# EAGLE design radio_module_V3.0 (EAGLE 7.3.0)
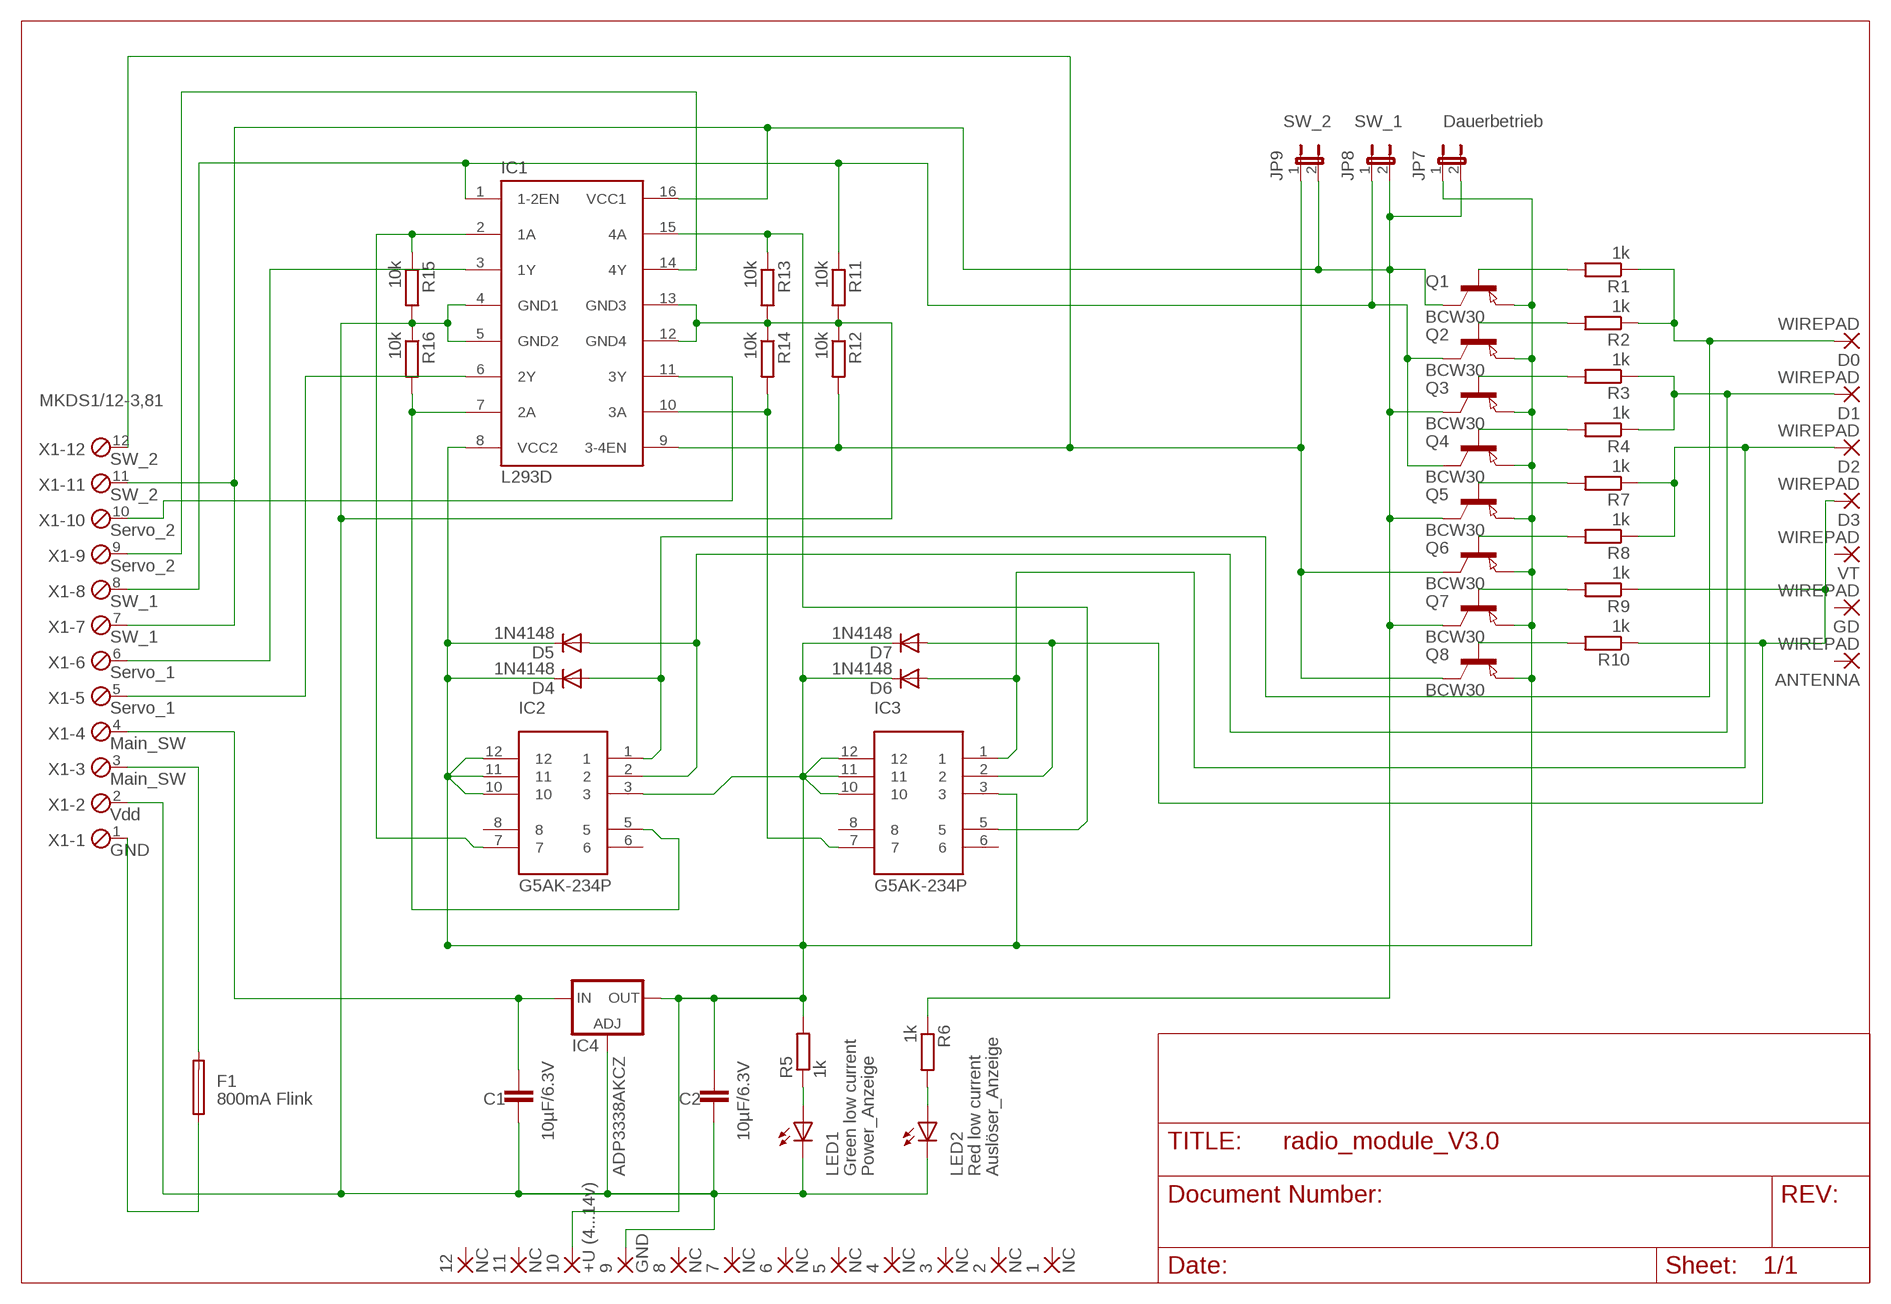
[diagram p0: schematic, sheet 1]

## Parts
1  NC  1,6/0,9  [1,6/0,9]
2  NC  1,6/0,9  [1,6/0,9]
3  NC  1,6/0,9  [1,6/0,9]
4  NC  1,6/0,9  [1,6/0,9]
5  NC  1,6/0,9  [1,6/0,9]
6  NC  1,6/0,9  [1,6/0,9]
7  NC  1,6/0,9  [1,6/0,9]
8  NC  1,6/0,9  [1,6/0,9]
9  GND  1,6/0,9  [1,6/0,9]
10  +U (4...14v)  1,6/0,9  [1,6/0,9]
11  NC  1,6/0,9  [1,6/0,9]
12  NC  1,6/0,9  [1,6/0,9]
ANTENNA  WIREPAD  1,6/0,9  [1,6/0,9]
C1  10µF/6.3V  C-EUC0805  [C0805]
C2  10µF/6.3V  C-EUC0805  [C0805]
D0  WIREPAD  1,6/0,9  [1,6/0,9]
D1  WIREPAD  1,6/0,9  [1,6/0,9]
D2  WIREPAD  1,6/0,9  [1,6/0,9]
D3  WIREPAD  1,6/0,9  [1,6/0,9]
D4  1N4148  1N4148DO35-7  [DO35-7]
D5  1N4148  1N4148DO35-7  [DO35-7]
D6  1N4148  1N4148DO35-7  [DO35-7]
D7  1N4148  1N4148DO35-7  [DO35-7]
F1  800mA Flink  FUSE19560  [19560]
GD  WIREPAD  1,6/0,9  [1,6/0,9]
IC1  L293D  [DIL16]
IC2  G5AK-234P  [G5AK-234P]
IC3  G5AK-234P  [G5AK-234P]
IC4  ADP3338AKCZ  LD117AS12TR  [SOT223]
JP7  Dauerbetrieb  JP1E  [JP1]
JP8  SW_1  JP1E  [JP1]
JP9  SW_2  JP1E  [JP1]
LED1  Green low current  LED3MM  [LED3MM]
LED2  Red low current  LED3MM  [LED3MM]
Q1  BCW30  PNP-TRANSISTOR_SOT23  [SOT23]
Q2  BCW30  PNP-TRANSISTOR_SOT23  [SOT23]
Q3  BCW30  PNP-TRANSISTOR_SOT23  [SOT23]
Q4  BCW30  PNP-TRANSISTOR_SOT23  [SOT23]
Q5  BCW30  PNP-TRANSISTOR_SOT23  [SOT23]
Q6  BCW30  PNP-TRANSISTOR_SOT23  [SOT23]
Q7  BCW30  PNP-TRANSISTOR_SOT23  [SOT23]
Q8  BCW30  PNP-TRANSISTOR_SOT23  [SOT23]
R1  1k  R-EU_R0402  [R0402]
R2  1k  R-EU_R0402  [R0402]
R3  1k  R-EU_R0402  [R0402]
R4  1k  R-EU_R0402  [R0402]
R5  1k  R-EU_R0402  [R0402]
R6  1k  R-EU_R0402  [R0402]
R7  1k  R-EU_R0402  [R0402]
R8  1k  R-EU_R0402  [R0402]
R9  1k  R-EU_R0402  [R0402]
R10  1k  R-EU_R0402  [R0402]
R11  10k  R-EU_R0402  [R0402]
R12  10k  R-EU_R0402  [R0402]
R13  10k  R-EU_R0402  [R0402]
R14  10k  R-EU_R0402  [R0402]
R15  10k  R-EU_R0402  [R0402]
R16  10k  R-EU_R0402  [R0402]
VT  WIREPAD  1,6/0,9  [1,6/0,9]
X1  MKDS1/12-3,81  [12POL381]

## Nets
GND: 9.1(P) C1.2 C2.2 IC1.4(GND1) IC1.5(GND2) IC1.12(GND4) IC1.13(GND3) IC4.1(ADJ) LED1.K(C) LED2.K(C) R11.2 R12.1 R13.2 R14.1 R15.2 R16.1 X1.2
N$1: IC1.3(1Y) X1.6
N$2: IC1.6(2Y) X1.5
N$3: IC1.7(2A) IC2.5 R16.2
N$4: IC1.11(3Y) X1.10
N$5: Q1.1(B) R1.2
N$6: Q3.1(B) R3.2
N$7: Q5.1(B) R7.2
N$8: Q7.1(B) R9.2
N$9: Q2.1(B) R2.2
N$10: Q4.1(B) R4.2
N$11: Q6.1(B) R8.2
N$12: Q8.1(B) R10.2
N$14: IC1.16(VCC1) JP7.2 JP8.2 JP9.2 Q1.3(C) Q3.3(C) Q5.3(C) Q7.3(C) R6.1 X1.7 X1.11
N$16: IC1.2(1A) IC2.7 R15.1
N$18: D0.1(P) D4.A IC2.1 R1.1 R2.1
N$19: LED2.A R6.2
N$20: F1.1 X1.1
N$21: D1.1(P) D5.A IC2.2 R3.1 R4.1
N$22: IC1.14(4Y) X1.9
N$24: F1.2 X1.3
N$25: D3.1(P) D7.A IC3.2 R9.1 R10.1
N$26: IC1.10(3A) IC3.7 R14.2
N$27: IC1.15(4A) IC3.5 R13.1
N$28: C1.1 IC4.3(IN) X1.4
N$31: LED1.A R5.1
N$32: D2.1(P) D6.A IC3.1 R7.1 R8.1
N$33: IC1.1(1-2EN) JP8.1 Q2.3(C) Q4.3(C) R11.1 X1.8
N$34: IC1.9(3-4EN) JP9.1 Q6.3(C) Q8.3(C) R12.2 X1.12
VDD: 10.1(P) C2.1 D4.C D5.C D6.C D7.C IC1.8(VCC2) IC2.3 IC2.10 IC2.11 IC2.12 IC3.3 IC3.10 IC3.11 IC3.12 IC4.4(OUT) JP7.1 Q1.2(E) Q2.2(E) Q3.2(E) Q4.2(E) Q5.2(E) Q6.2(E) Q7.2(E) Q8.2(E) R5.2
Unconnected: 1.1(P) 2.1(P) 3.1(P) 4.1(P) 5.1(P) 6.1(P) 7.1(P) 8.1(P) 11.1(P) 12.1(P) ANTENNA.1(P) GD.1(P) IC2.6 IC2.8 IC3.6 IC3.8 VT.1(P)

## Notes on the sheet
- SW_2
- SW_2
- Servo_2
- Servo_2
- SW_1
- SW_1
- Servo_1
- Servo_1
- Main_SW
- Main_SW
- Vdd
- GND
- Power_Anzeige | Auslöser_Anzeige

## Library data of the parts
1-12 ANTENNA D0 D1-D3 GD VT = wirepad:1,6/0,9: THROUGH-HOLE PAD
C1 C2 = rcl:C-EU: CAPACITOR, European symbol
D4-D7 = diode:1N4148: DIODE high speed (Philips)
F1 = fuse:FUSE: Fuse
IC1 = st-microelectronics:L293D: PUSH-PULL 4 CHANNEL DRIVER
IC2 IC3 = omron:G5AK-234P
IC4 = v-reg:LD117A?*: Low drop fixed and adjustable positive voltage regulators 1 A Source: http://www.st.com/stonline/products/literature/ds/7194/ld1117axx.pdf
JP7-JP9 = jumper:JP1E: JUMPER
LED1 LED2 = led:LED: LED OSRAM: - CHIPLED LG R971, LG N971, LY N971, LG Q971, LY Q971, LO R971, LY R971 LH N974, LH R974 LS Q976, LO Q976, LY Q976 LO Q996 - Hyper CHIPLED LW Q18S LB Q993, LB Q99A, LB R99A - SideLED LS A670, LO A670, LY A670, LG A670, LP A670 LB A673, LV A673, LT A673, LW A673 LH A674 LY A675 LS A676, LA A676, LO A676, LY A676, LW A676 LS A679, LY A679, LG A679 - Hyper Micro SIDELED® LS Y876, LA Y876, LO Y876, LY Y876 LT Y87S - SmartLED LW L88C, LW L88S LB L89C, LB L89S, LG L890 LS L89K, LO L89K, LY L89K LS L896, LA L896, LO L896, LY L896 - TOPLED LS T670, LO T670, LY T670, LG T670, LP T670 LSG T670, LSP T670, LSY T670, LOP T670, LYG T670 LG T671, LOG T671, LSG T671 LB T673, LV T673, LT T673, LW T673 LH T674 LS T676, LA T676, LO T676, LY T676, LB T676, LH T676, LSB T676, LW T676 LB T67C, LV T67C, LT T67C, LS T67K, LO T67K, LY T67K, LW E67C LS E67B, LA E67B, LO E67B, LY E67B, LB E67C, LV E67C, LT E67C LW T67C LS T679, LY T679, LG T679 LS T770, LO T770, LY T770, LG T770, LP T770 LB T773, LV T773, LT T773, LW T773 LH T774 LS E675, LA E675, LY E675, LS T675 LS T776, LA T776, LO T776, LY T776, LB T776 LHGB T686 LT T68C, LB T68C - Hyper Mini TOPLED® LB M676 - Mini TOPLED Santana® LG M470 LS M47K, LO M47K, LY M47K Source: http://www.osram.convergy.de LUXEON: - LUMILED® LXK2-PW12-R00, LXK2-PW12-S00, LXK2-PW14-U00, LXK2-PW14-V00 LXK2-PM12-R00, LXK2-PM12-S00, LXK2-PM14-U00 LXK2-PE12-Q00, LXK2-PE12-R00, LXK2-PE12-S00, LXK2-PE14-T00, LXK2-PE14-U00 LXK2-PB12-K00, LXK2-PB12-L00, LXK2-PB12-M00, LXK2-PB14-N00, LXK2-PB14-P00, LXK2-PB14-Q00 LXK2-PR12-L00, LXK2-PR12-M00, LXK2-PR14-Q00, LXK2-PR14-R00 LXK2-PD12-Q00, LXK2-PD12-R00, LXK2-PD12-S00 LXK2-PH12-R00, LXK2-PH12-S00 LXK2-PL12-P00, LXK2-PL12-Q00, LXK2-PL12-R00 Source: www.luxeon.com KINGBRIGHT: KA-3528ASYC Source: www.kingbright.com
Q1-Q8 = semicon-smd-ipc:PNP-TRANSISTOR_: PNP TRANSISTOR
R1-R16 = resistor:R-EU_: RESISTOR, European symbol
X1 = con-phoenix-381:MKDS1/12-3,81: MKDS 1/12-3,81 - Order No. 1727117 Pitch: 3,81mm Number of terminals: 12 Rated Voltage: 160V Maximum load current/ cross section: 12A/1.5mm2-AWG16 Housing Interlocking: none Color: Green

## Board
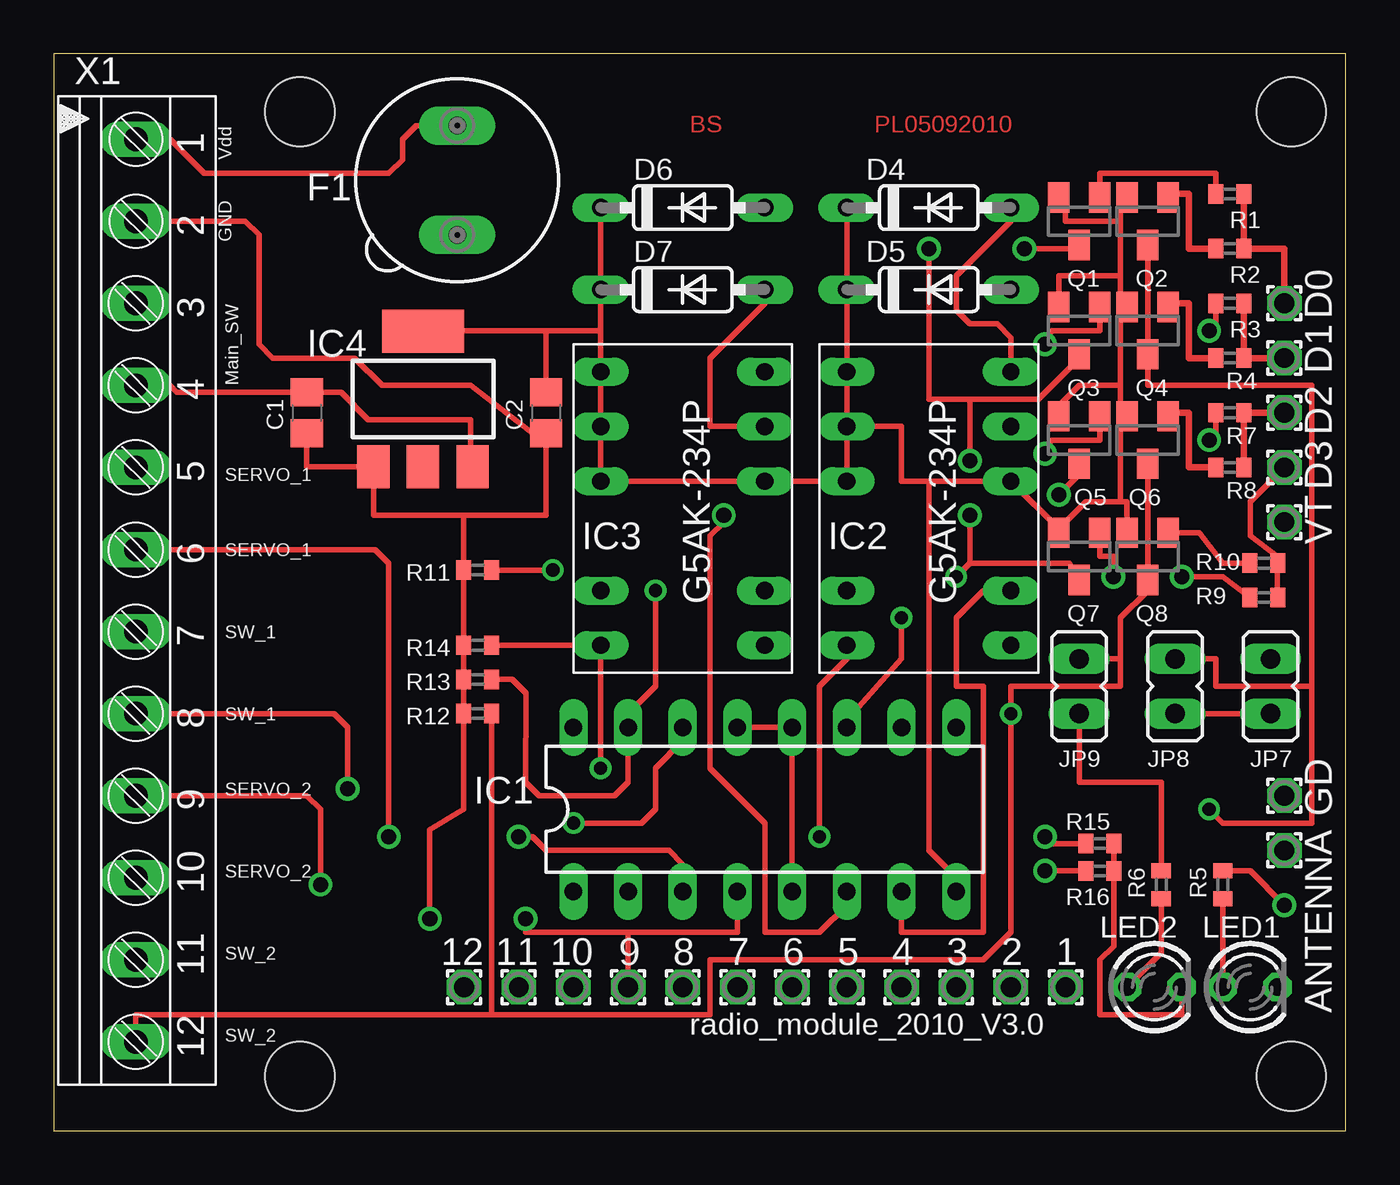
[diagram p1: board, top side]
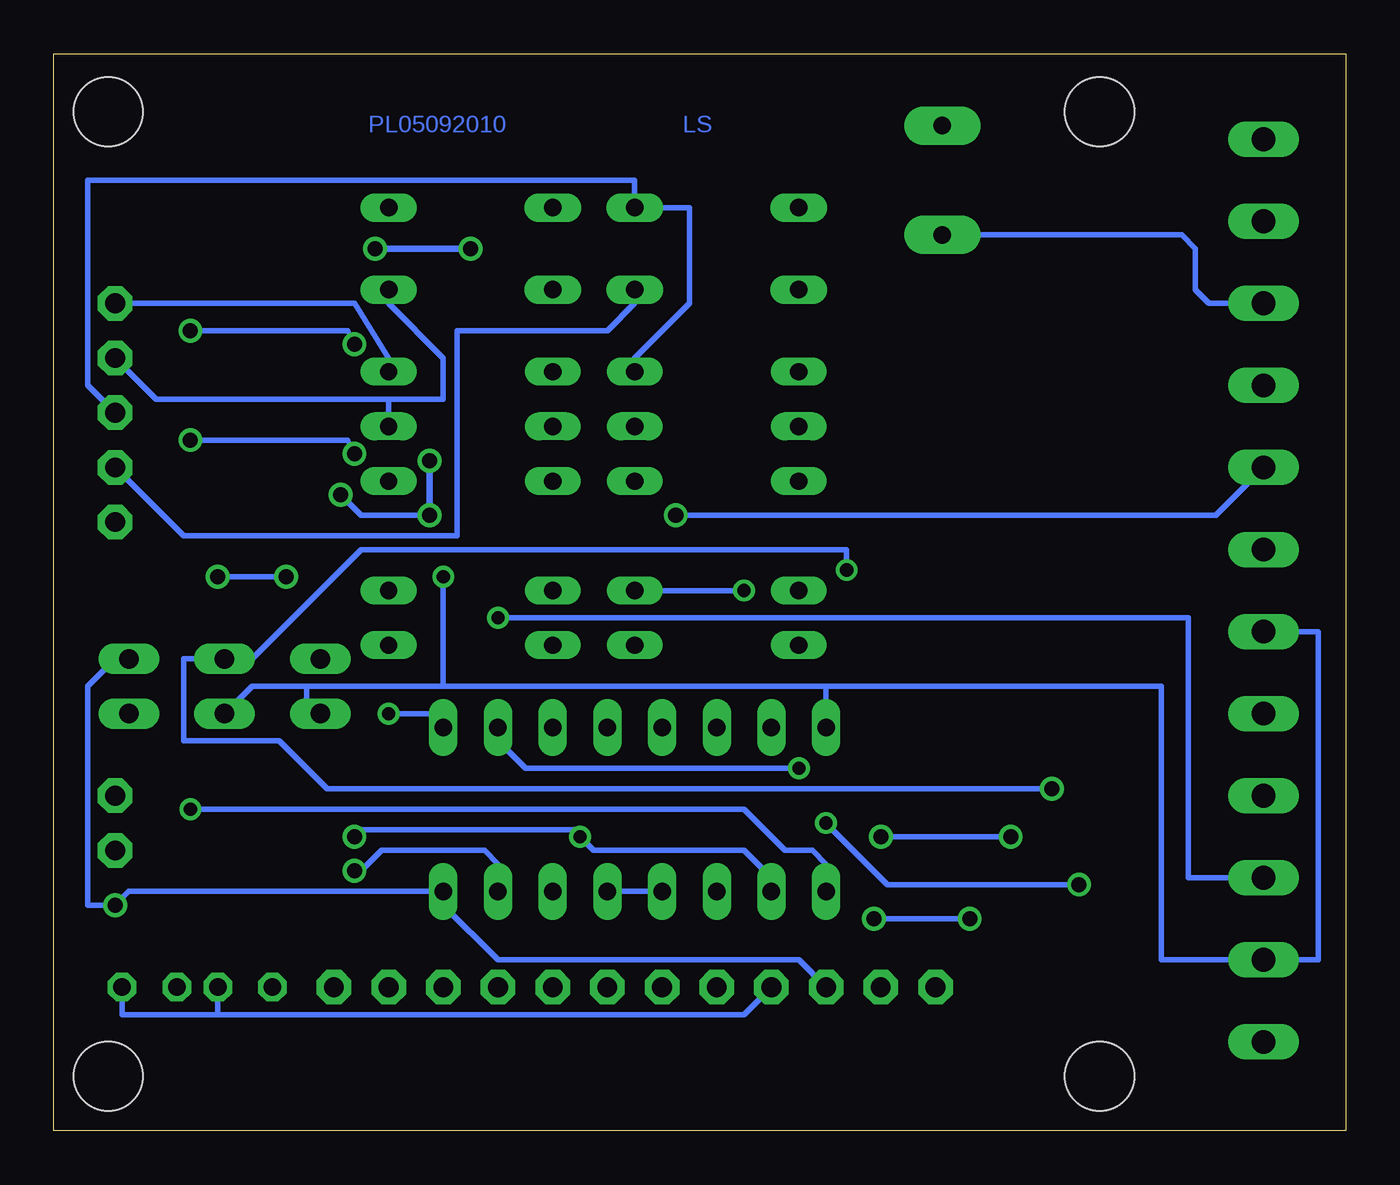
[diagram p2: board, bottom side, seen from below]

Size 60 x 50 mm. Coordinates in mm from the lower left corner, seen from the top.
Outline: 0,0 60,0 60,50 0,50 0,0
Copper layers (1*16): Top 0.035mm / dielectric 1.5mm / Bottom 0.035mm
Design rules "default *": minimum track width 10mil, minimum drill 24mil, track to track 8mil, track to pad 8mil, pad to pad 8mil, via to via 8mil, smd to smd 8mil, copper to edge 40mil, drill to drill 8mil, minimum pad ring 10mil, minimum via ring 8mil, stop-mask expansion 4mil, vias tented up to drill 0mil, thermal gap 10mil
Holes 3.2 mm at 57.47,47.31 57.47,2.54 11.43,2.54 11.43,47.31

### Footprints (pad centres in the part's own frame; a part is rotated, then mirrored left to right if it is on the bottom)
1,6/0,9 = drill 0.914 pad 1.6 octagon: 1 0,0
C0805 = smd 1.3 x 1.5: 1 -0.95,0; 2 0.95,0
DO35-7 = drill 0.813 long: A 3.81,0; C -3.81,0
19560 = drill 0.813 pad 1.778 long: 1 -2.54,0; 2 2.54,0
DIL16 = drill 0.813 long: 1 -8.89,-3.81; 2 -6.35,-3.81; 3 -3.81,-3.81; 4 -1.27,-3.81; 5 1.27,-3.81; 6 3.81,-3.81; 7 6.35,-3.81; 8 8.89,-3.81; 9 8.89,3.81; 10 6.35,3.81; 11 3.81,3.81; 12 1.27,3.81; 13 -1.27,3.81; 14 -3.81,3.81; 15 -6.35,3.81; 16 -8.89,3.81
G5AK-234P = drill 0.8 long: 1 1.27,8.89; 2 3.81,8.89; 3 6.35,8.89; 5 11.43,8.89; 6 13.97,8.89; 7 13.97,1.27; 8 11.43,1.27; 10 6.35,1.27; 11 3.81,1.27; 12 1.27,1.27
SOT223 = smd 1.5 x 2: 1 -2.3,-3.15; 2 0,-3.15; 3 2.3,-3.15 | smd 3.8 x 2: 4 0,3.15
JP1 = drill 0.914 long: 1 0,-1.27; 2 0,1.27
LED3MM = drill 0.813 octagon: A -1.27,0; K 1.27,0
SOT23 = smd 1 x 1.4: 1 -0.95,-1.1; 2 0.95,-1.1; 3 0,1.1
R0402 = smd 0.7 x 0.9: 1 -0.65,0; 2 0.65,0
12POL381 = drill 1.1 long: 1 0,0; 2 3.81,0; 3 7.62,0; 4 11.43,0; 5 15.24,0; 6 19.05,0; 7 22.86,0; 8 26.67,0; 9 30.48,0; 10 34.29,0; 11 38.1,0; 12 41.91,0

### Placement (x,y rotation side)
1  46.99,6.67 0 top
2  44.45,6.67 0 top
3  41.91,6.67 0 top
4  39.37,6.67 0 top
5  36.83,6.67 0 top
6  34.29,6.67 0 top
7  31.75,6.67 0 top
8  29.21,6.67 0 top
9  26.67,6.67 0 top
10  24.13,6.67 0 top
11  21.59,6.67 0 top
12  19.05,6.67 0 top
ANTENNA  57.15,13.02 270 top
C1  11.75,33.34 270 top
C2  22.86,33.34 270 top
D0  57.15,38.42 270 top
D1  57.15,35.88 270 top
D2  57.15,33.34 270 top
D3  57.15,30.8 270 top
D4  40.64,42.86 0 top
D5  40.64,39.05 0 top
D6  29.21,42.86 0 top
D7  29.21,39.05 0 top
F1  18.73,44.13 270 top
GD  57.15,15.56 90 top
IC1  33.02,14.92 0 top
IC2  35.56,36.51 270 top
IC3  24.13,36.51 270 top
IC4  17.14,33.97 0 top
JP7  56.52,20.64 180 top
JP8  52.07,20.64 180 top
JP9  47.62,20.64 180 top
LED1  55.56,6.67 0 top
LED2  51.12,6.67 0 top
Q1  47.62,42.23 180 top
Q2  50.8,42.23 180 top
Q3  47.62,37.15 180 top
Q4  50.8,37.15 180 top
Q5  47.62,32.07 180 top
Q6  50.8,32.07 180 top
Q7  47.62,26.67 180 top
Q8  50.8,26.67 180 top
R1  54.61,43.5 180 top
R2  54.61,40.96 180 top
R3  54.61,38.42 180 top
R4  54.61,35.88 180 top
R5  54.29,11.43 90 top
R6  51.44,11.43 270 top
R7  54.61,33.34 180 top
R8  54.61,30.8 180 top
R9  56.2,24.77 180 top
R10  56.2,26.35 180 top
R11  19.68,26.04 180 top
R12  19.68,19.37 0 top
R13  19.68,20.95 180 top
R14  19.68,22.54 0 top
R15  48.58,13.34 0 top
R16  48.58,12.06 180 top
VT  57.15,28.26 270 top
X1  3.81,46.04 270 top

### Tracks (layer width: path | path; a pad name or v marks a point on that pad's centre or on a via)
GND  (via drill 0.7)
  Top 0.254: 26.67,9.21 9.1 | 26.67,9.21 31.75,9.21 IC1.4 | 26.67,9.21 21.91,9.21 v21.91,9.84 | v17.46,9.84 17.46,13.97 19.04,14.92 R12.1 R13.2 R14.1 R11.2 | IC1.5 IC1.12 IC1.13 | R11.2 | R15.2 R16.1 49.23,8.56 48.58,7.94 48.58,5.4 52.39,5.4 LED2.K | C1.2 11.75,30.82 IC4.1 14.85,28.57 19.05,28.57 | X1.2 8.89,42.23 9.53,41.59 9.53,36.51 10.16,35.88 13.97,35.88 15.24,34.61 19.37,34.61 22.23,32.38 22.23,32.39 C2.2 22.86,28.57 19.05,28.57 | R11.2 19.04,28.56 19.05,28.57
  Bottom 0.254: 9.1 27.94,5.4 52.39,5.4 | v17.46,9.84 v21.91,9.84 | IC1.4 IC1.5 | 52.39,5.4 LED2.K | 52.39,5.4 56.83,5.4 LED1.K
N$1  (via drill 0.7)
  Top 0.254: v21.59,13.65 22.23,13.65 22.86,13.02 28.57,13.02 29.21,12.38 IC1.3 | v15.56,13.65 15.56,26.35 14.92,26.99 X1.6
  Bottom 0.254: v15.56,13.65 v21.59,13.65
N$2  (via drill 0.7)
  Top 0.254: v31.11,28.57 31.11,28.26 30.48,27.62 30.48,16.83 33.02,14.29 33.02,9.21 35.56,9.21 36.83,10.48 IC1.6
  Bottom 0.254: v31.11,28.57 6.03,28.57 X1.5
N$3  (via drill 0.7 pad 0.81)
  Top 0.254: IC2.5 43.18,25.08 41.91,23.81 41.91,20.64 43.18,20.64 43.18,9.21 39.37,9.21 IC1.7 | v46.04,12.06 R16.2
  Bottom 0.254: v46.04,12.06 45.72,12.06 44.77,13.02 40.01,13.02 39.37,12.38 IC1.7
N$4  (via drill 0.61)
  Top 0.254: v39.37,23.81 39.37,21.91 36.83,19.05 IC1.11
  Bottom 0.254: v39.37,23.81 7.3,23.81 7.3,11.75 X1.10
N$5
  Top 0.254: Q1.1 48.58,44.45 53.98,44.45 53.98,43.5
  Top 0.305: 53.98,43.5 R1.2
N$6  (via drill 0.7)
  Top 0.254: v53.66,37.15 53.96,37.15 R3.2 | Q3.1 48.58,37.15 46.35,37.15 v46.04,36.51
  Top 0.305: R3.2 53.98,38.42
  Bottom 0.254: v46.04,36.51 46.35,37.15 v53.66,37.15
N$7  (via drill 0.7)
  Top 0.254: 53.98,33.34 R7.2 53.96,32.07 v53.66,32.07 | Q5.1 48.58,32.07 46.35,32.07 v46.04,31.43
  Bottom 0.254: v46.04,31.43 46.35,32.07 v53.66,32.07
N$8  (via drill 0.7)
  Top 0.254: Q7.1 48.58,26.67 49.21,26.67 v49.21,25.72 | v52.39,25.72 54.29,25.72 R9.2
  Bottom 0.254: v49.21,25.72 v52.39,25.72
N$9
  Top 0.305: R2.2 52.7,40.96 52.7,43.5 51.75,43.5 Q2.1
N$10
  Top 0.305: R4.2 52.7,35.88 52.7,38.42 51.75,38.42 Q4.1
N$11
  Top 0.305: R8.2 52.7,30.8 52.7,33.34 51.75,33.34 Q6.1
N$12
  Top 0.254: Q8.1 53.19,27.77 54.29,26.35 R10.2
N$14  (via drill 0.61, 0.7)
  Top 0.254: JP8.2 JP7.2 | 42.55,26.35 v42.55,28.57 | 42.55,26.35 47.16,26.35 Q7.3 | 42.55,33.97 45.72,33.97 | v42.55,31.11 42.55,33.97 | v40.64,40.96 40.64,33.97 42.55,33.97 | Q5.3 47.62,30.48 v46.67,29.53 | v41.91,25.72 42.55,26.35 | R6.1 51.44,16.19 47.62,16.19 JP9.2 | v45.09,40.96 47.45,40.96 Q1.3
  Top 0.305: Q3.3 47.62,35.88 45.72,33.97
  Bottom 0.254: 24.13,20.64 41.91,20.64 | 41.91,20.64 48.26,20.64 | 48.26,20.64 50.8,20.64 JP8.2 | 24.13,20.64 IC1.16 | 48.26,20.64 48.26,19.37 JP9.2 | 41.91,20.64 v41.91,25.72 | v46.67,29.53 45.72,28.57 v42.55,28.57 | 24.13,20.64 8.57,20.64 8.57,7.94 X1.11 1.27,7.94 1.27,23.18 X1.7
  Bottom 0.305: v42.55,28.57 v42.55,31.11 | v40.64,40.96 v45.09,40.96
N$16  (via drill 0.61, 0.7 pad 0.81)
  Top 0.254: v35.56,13.65 35.56,20.64 36.83,21.91 IC2.7 | v46.04,13.65 46.35,13.34 R15.1
  Bottom 0.254: IC1.2 26.67,11.75 27.94,13.02 34.92,13.02 v35.56,13.65 35.88,13.97 45.72,13.97 v46.04,13.65
N$18
  Top 0.254: D4.A 44.45,42.23 41.91,39.69 41.91,38.1 42.55,37.47 43.81,37.47 44.45,36.83 IC2.1
  Top 0.305: R1.1 R2.1 57.15,40.96 D0.1
  Bottom 0.254: D0.1 46.04,38.42 44.45,35.88 IC2.1
N$19
  Top 0.254: LED2.A 51.44,8.26 R6.2
N$20
  Top 0.254: X1.1 5.4,46.04 6.99,44.45 15.56,44.45 16.19,45.09 16.19,46.04 16.83,46.67 F1.1
N$21
  Top 0.305: R3.1 R4.1 D1.1
  Bottom 0.254: 44.45,33.97 55.24,33.97 D1.1 | 44.45,33.97 41.91,33.97 41.91,35.88 44.45,38.42 D5.A | IC2.2 44.45,33.97
N$22  (via drill 0.61, 0.7)
  Top 0.254: v24.13,14.29 27.3,14.29 27.94,14.92 27.94,16.83 29.21,18.1 IC1.14 | X1.9 11.75,15.56 12.38,14.92 v12.38,11.43
  Bottom 0.254: v24.13,14.29 21.27,11.43 v12.38,11.43
N$24
  Bottom 0.254: X1.3 6.35,38.42 6.99,39.05 6.99,40.96 7.62,41.59 F1.2
N$25
  Top 0.254: IC3.2 30.48,32.7 30.48,35.88 33.02,38.42 D7.A | R9.1 56.83,24.78 56.83,26.35 R10.1 56.85,26.66 55.56,27.62 55.56,29.21 D3.1
  Bottom 0.254: D7.A 33.02,38.42 34.29,37.15 41.27,37.15 41.27,27.62 53.98,27.62 D3.1
N$26  (via drill 0.61)
  Top 0.254: v25.4,16.83 IC3.7 R14.2
  Bottom 0.254: v25.4,16.83 38.1,16.83 39.37,18.1 IC1.10
N$27  (via drill 0.61)
  Top 0.254: v27.94,25.08 27.94,20.64 26.67,19.37 IC1.15 26.67,16.19 26.04,15.56 22.54,15.56 21.91,16.19 21.91,16.18 21.92,20.3 21.27,20.95 R13.1
  Bottom 0.254: v27.94,25.08 IC3.5
N$28
  Top 0.254: X1.4 5.4,34.61 5.71,34.29 C1.1 13.34,34.29 14.61,33.02 19.37,33.02 19.37,30.9 IC4.3
N$31
  Top 0.254: LED1.A R5.1
N$32
  Top 0.305: R8.1 R7.1 D2.1
  Bottom 0.254: IC3.1 33.02,35.88 30.48,38.42 30.48,42.86 D6.A 33.02,44.13 58.42,44.13 58.42,34.61 D2.1
N$33  (via drill 0.61, 0.7)
  Top 0.254: Q2.3 Q4.3 50.8,34.61 58.42,34.61 58.42,20.64 | v53.66,14.92 54.29,14.29 58.42,14.29 58.42,20.64 | v23.18,26.04 R11.1 | JP8.1 53.98,21.91 53.98,20.64 58.42,20.64 | v13.65,15.88 13.65,18.73 13.02,19.37 X1.8
  Bottom 0.254: v13.65,15.88 47.31,15.88 49.53,18.1 53.98,18.1 53.98,21.91 JP8.1 50.8,21.91 45.72,26.99 23.18,26.99 v23.18,26.04 | v53.66,14.92 27.94,14.92 26.04,13.02 24.77,13.02 24.13,12.38 IC1.1
N$34  (via drill 0.61)
  Top 0.254: Q6.3 Q8.3 50.8,25.08 49.53,23.81 49.53,21.91 | 49.53,21.91 49.53,20.64 44.45,20.64 v44.45,19.37 44.45,9.21 43.18,7.94 30.48,7.94 30.48,5.4 20.32,5.4 | 49.53,21.91 JP9.1 | R12.2 20.32,11.11 20.32,5.4 | 20.32,5.4 3.81,5.4 X1.12
  Bottom 0.254: v44.45,19.37 41.91,19.37 IC1.9
VDD  (via drill 0.7)
  Top 0.254: D6.C D7.C 25.4,37.15 | 49.53,42.23 49.53,43.5 Q2.2 | 49.53,39.69 49.53,42.23 | Q3.2 46.67,39.69 49.53,39.69 | 49.53,42.23 46.99,42.23 46.99,43.5 Q1.2 | 46.67,27.94 IC2.3 40.64,30.16 | 49.53,29.21 49.53,33.34 | 49.53,29.21 49.85,29.21 Q8.2 | 49.53,34.61 47.62,34.61 46.67,33.66 Q5.2 | 49.53,34.61 49.53,38.42 | 49.53,33.34 49.53,34.61 | 49.53,33.34 Q6.2 | 46.67,27.94 47.94,29.21 49.53,29.21 | 46.67,27.94 Q7.2 | 49.53,38.42 49.53,39.69 | 49.53,38.42 Q4.2 | 40.64,30.16 39.37,30.16 39.37,32.7 IC2.11 | 40.64,30.16 40.64,13.02 41.91,11.75 IC1.8 | D4.C D5.C IC2.12 IC2.11 | 25.4,37.15 IC3.12 IC3.11 IC3.10 IC3.3 IC2.10 IC2.11 | v57.15,10.48 55.56,12.06 54.29,12.06 R5.2 | 22.86,37.15 C2.1 | 25.4,37.15 22.86,37.15 | 22.86,37.15 17.14,37.15 IC4.4
  Bottom 0.254: 10.1 25.4,7.94 39.37,7.94 41.91,10.48 IC1.8 56.52,11.11 v57.15,10.48 58.42,10.48 58.42,20.64 57.15,21.91 JP7.1

### Text on the board
Top: BS | PL05092010
Bottom: LS | PL05092010
tNames: Vdd | GND | Main_SW | SERVO_1 | IC3 | IC2 | SERVO_1 | SW_1 | SW_1 | SERVO_2 | SERVO_2 | SW_2 | SW_2 | radio_module_2010_V3.0